# Altium schematic sheet PRG_v2.0.SchDoc
size 419 x 296 mm
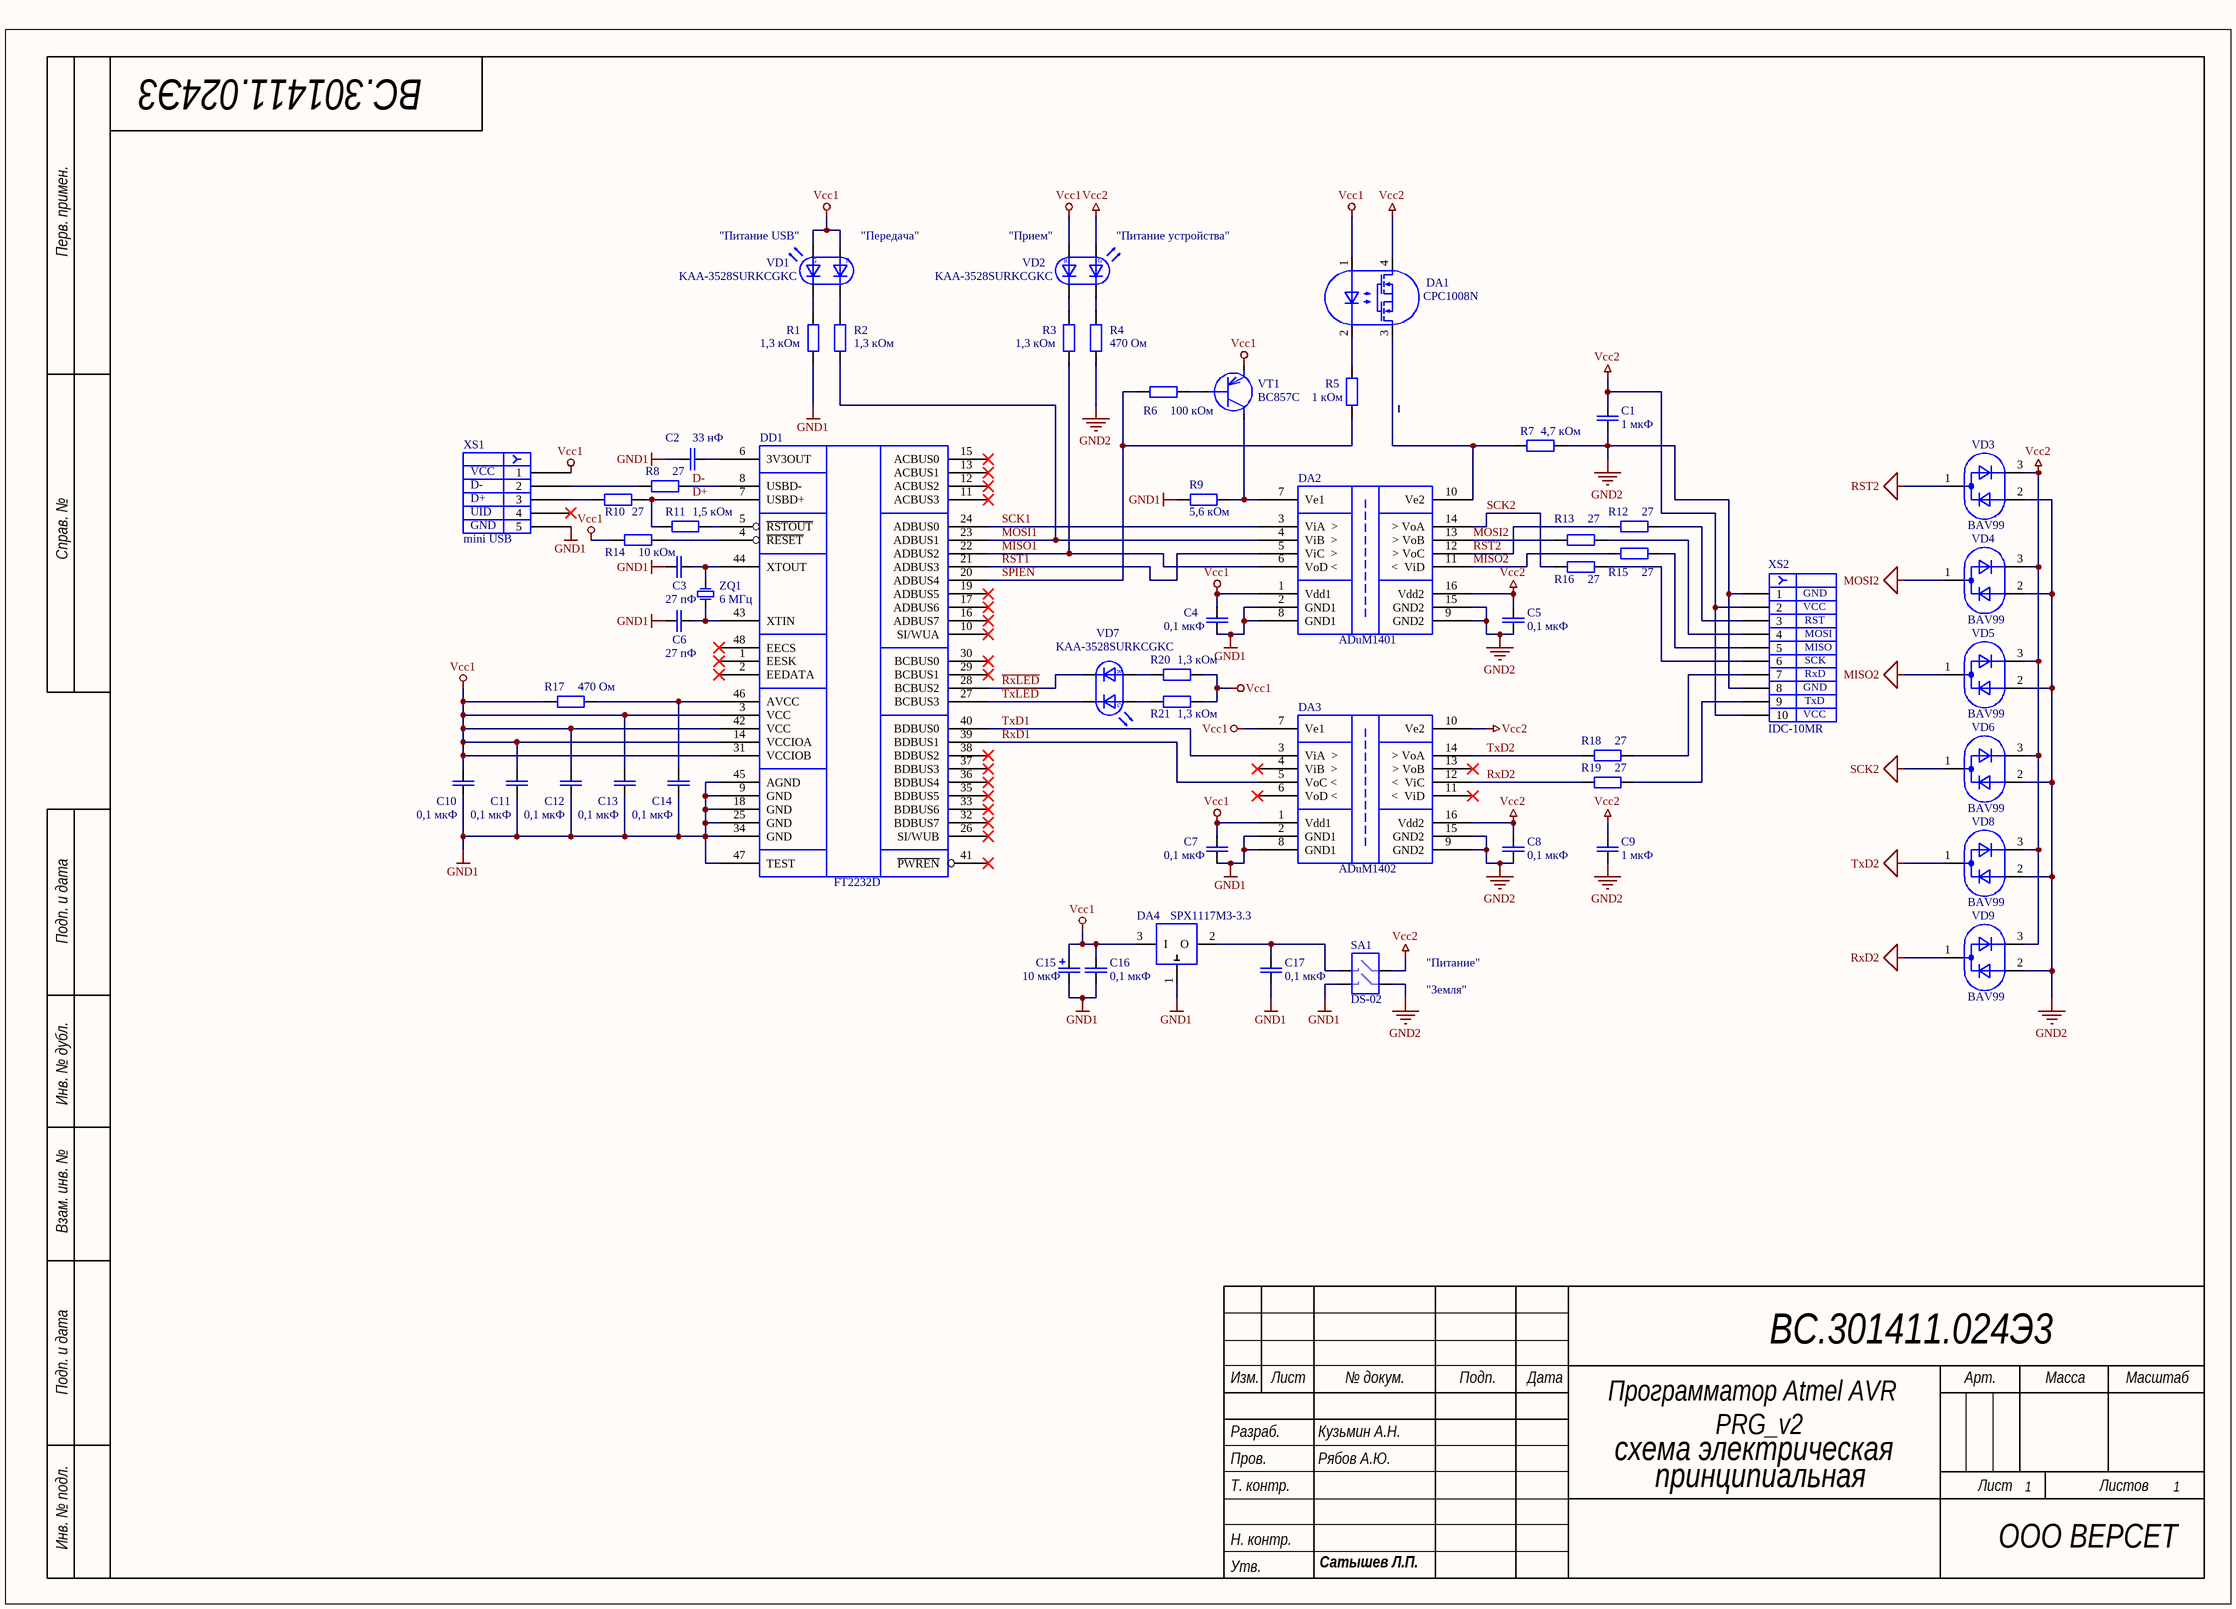
[diagram p0: PRG_v2.0.SchDoc]

## Parts
C1  Номинал: 1 мкФ  [0603]  (hidden comment: Конденсатор)
C2  Номинал: 33 нФ  [0603]  (hidden comment: Конденсатор)
C3  Номинал: 27 пФ  [0603]  (hidden comment: Конденсатор)
C4  Номинал: 0,1 мкФ  [0603]  (hidden comment: Конденсатор)
C5  Номинал: 0,1 мкФ  [0603]  (hidden comment: Конденсатор)
C6  Номинал: 27 пФ  [0603]  (hidden comment: Конденсатор)
C7  Номинал: 0,1 мкФ  [0603]  (hidden comment: Конденсатор)
C8  Номинал: 0,1 мкФ  [0603]  (hidden comment: Конденсатор)
C9  Номинал: 1 мкФ  [0603]  (hidden comment: Конденсатор)
C10  Номинал: 0,1 мкФ  [0603]  (hidden comment: Конденсатор)
C11  Номинал: 0,1 мкФ  [0603]  (hidden comment: Конденсатор)
C12  Номинал: 0,1 мкФ  [0603]  (hidden comment: Конденсатор)
C13  Номинал: 0,1 мкФ  [0603]  (hidden comment: Конденсатор)
C14  Номинал: 0,1 мкФ  [0603]  (hidden comment: Конденсатор)
C15  Номинал: 10 мкФ  [C+A]  (hidden comment: Конденсатор электролитический)
C16  Номинал: 0,1 мкФ  [0603]  (hidden comment: Конденсатор)
C17  Номинал: 0,1 мкФ  [0603]  (hidden comment: Конденсатор)
DA1  Оптопара  [SOIC4]  (value not drawn)
DA2  Буфер с гальванической развязкой  [SOIC16]  (value not drawn)
DA3  Буфер с гальванической развязкой  [SOIC16]  (value not drawn)
DA4  Type: SPX1117M3-3.3  [SOT223]  (hidden comment: Стабилизатор напряжения)
DD1  Dual USB to Serial UART/FIFO IC  [LQFP48]  (value not drawn)
R1  Номинал: 1,3 кОм  [0603]  (hidden comment: Резистор)
R2  Номинал: 1,3 кОм  [0603]  (hidden comment: Резистор)
R3  Номинал: 1,3 кОм  [0603]  (hidden comment: Резистор)
R4  Номинал: 470 Ом  [0603]  (hidden comment: Резистор)
R5  Номинал: 1 кОм  [0603]  (hidden comment: Резистор)
R6  Номинал: 100 кОм  [0603]  (hidden comment: Резистор)
R7  Номинал: 4,7 кОм  [0603]  (hidden comment: Резистор)
R8  Номинал: 27  [0603]  (hidden comment: Резистор)
R9  Номинал: 5,6 кОм  [0603]  (hidden comment: Резистор)
R10  Номинал: 27  [0603]  (hidden comment: Резистор)
R11  Номинал: 1,5 кОм  [0603]  (hidden comment: Резистор)
R12  Номинал: 27  [0603]  (hidden comment: Резистор)
R13  Номинал: 27  [0603]  (hidden comment: Резистор)
R14  Номинал: 10 кОм  [0603]  (hidden comment: Резистор)
R15  Номинал: 27  [0603]  (hidden comment: Резистор)
R16  Номинал: 27  [0603]  (hidden comment: Резистор)
R17  Номинал: 470 Ом  [0603]  (hidden comment: Резистор)
R18  Номинал: 27  [0603]  (hidden comment: Резистор)
R19  Номинал: 27  [0603]  (hidden comment: Резистор)
R20  Номинал: 1,3 кОм  [0603]  (hidden comment: Резистор)
R21  Номинал: 1,3 кОм  [0603]  (hidden comment: Резистор)
SA1  Микропереключатель  [DS-02]  (value not drawn)
VD1  Светодиод двухцветный  [KAA-3528SURKCGKC]  (value not drawn)
VD2  Светодиод двухцветный  [KAA-3528SURKCGKC]  (value not drawn)
VD3  Пара защитный диодов Шоттки  [SOT23]  (value not drawn)
VD4  Пара защитный диодов Шоттки  [SOT23]  (value not drawn)
VD5  Пара защитный диодов Шоттки  [SOT23]  (value not drawn)
VD6  Пара защитный диодов Шоттки  [SOT23]  (value not drawn)
VD7  Светодиод двухцветный  [KAA-3528SURKCGKC]  (value not drawn)
VD8  Пара защитный диодов Шоттки  [SOT23]  (value not drawn)
VD9  Пара защитный диодов Шоттки  [SOT23]  (value not drawn)
VT1  Type: BC857C  [SOT23]  (hidden comment: Транзистор pnp)
XS1  Разъем мини-USB  [mini USB A]  (value not drawn)
XS2  IDC-10MR  [IDC-10MR]
ZQ1  Номинал: 6 МГц  [HC49-SM]  (hidden comment: Кварцевый резонатор)

## Nets
GND1: C2.1 C3.1 C4.1 C6.1 C7.1 C10.2 C11.2 C12.2 C13.2 C14.2 C15.2 C16.1 C17.1 DA2.2(GND1) DA2.8(GND1) DA3.2(GND1) DA3.8(GND1) DA4.1(GND) DD1.9(GND) DD1.18(GND) DD1.25(GND) DD1.34(GND) DD1.45(AGND) DD1.47(TEST) R1.1 R9.2 SA1.4 XS1.5
GND2: C1.1 C5.1 C8.1 C9.1 DA2.9(GND2) DA2.15(GND2) DA3.9(GND2) DA3.15(GND2) R4.2 R7.1 SA1.2 VD3.2 VD4.2 VD5.2 VD6.2 VD8.2 VD9.2 XS2.1 XS2.8
MISO2: DA2.11(<__ViD) R15.1 VD5.1
MOSI2: DA2.13(>_VoB) R13.1 VD4.1
RST2: DA2.12(>_VoC) R12.1 VD3.1
RxD2: DA3.12(<__ViC) R19.1 VD9.1
SCK2: DA2.14(>_VoA) R16.1 VD6.1
TxD2: DA3.14(>_VoA) R18.1 VD8.1
Vcc1: C4.2 C7.2 C10.1 C11.1 C12.1 C13.1 C15.1 C16.2 DA1.1(A) DA2.1(Vdd1) DA3.1(Vdd1) DA3.7(Ve1) DA4.3(I) DD1.3(VCC) DD1.14(VCCIOA) DD1.31(VCCIOB) DD1.42(VCC) R14.1 R17.1 R20.1 R21.1 VD1.2 VD1.4 VD2.2 VT1.3(Emitter) XS1.1
Vcc2: C1.2 C5.2 C8.2 C9.2 DA1.4(C) DA2.16(Vdd2) DA3.10(Ve2) DA3.16(Vdd2) SA1.1 VD2.4 VD3.3 VD4.3 VD5.3 VD6.3 VD8.3 VD9.3 XS2.2 XS2.10
D+: DD1.7(USBD+) R10.2 R11.1
D-: DD1.8(USBD-) R8.2
MISO1: DA2.6(VoD_<) DD1.22(ADBUS2) R3.1
MOSI1: DA2.4(ViB__>) DD1.23(ADBUS1) R2.1
~{RST}1: DA2.5(ViC__>) DD1.21(ADBUS3)
~{RxLED}: DD1.28(BCBUS2) VD7.1
RxD1: DA3.5(VoC_<) DD1.39(BDBUS1)
~{SPIEN}: DD1.20(ADBUS4) R5.1 R6.2
SCK1: DA2.3(ViA__>) DD1.24(ADBUS0)
~{TxLED}: DD1.27(BCBUS3) VD7.3
TxD1: DA3.3(ViA__>) DD1.40(BDBUS0)
NetC2_2: C2.2 DD1.6(3V3OUT)
NetC3_2: C3.2 DD1.44(XTOUT) ZQ1.2
NetC6_2: C6.2 DD1.43(XTIN) ZQ1.1
NetC14_1: C14.1 DD1.46(AVCC) R17.2
NetC17_2: C17.2 DA4.2(O) SA1.3
NetDA1_2: DA1.2(K) R5.2
NetDA1_3: DA1.3(E) DA2.10(Ve2) R7.2
NetDA2_7: DA2.7(Ve1) R9.1 VT1.1(Collector)
NetDD1_4: DD1.4(~{RESET}) R14.2
NetDD1_5: DD1.5(~{RSTOUT}) R11.2
NetR1_2: R1.2 VD1.3
NetR2_2: R2.2 VD1.1
NetR3_2: R3.2 VD2.1
NetR4_1: R4.1 VD2.3
NetR6_1: R6.1 VT1.2(Base)
NetR8_1: R8.1 XS1.2
NetR10_1: R10.1 XS1.3
NetR12_2: R12.2 XS2.3
NetR13_2: R13.2 XS2.4
NetR15_2: R15.2 XS2.5
NetR16_2: R16.2 XS2.6
NetR18_2: R18.2 XS2.7
NetR19_2: R19.2 XS2.9
NetR20_2: R20.2 VD7.2
NetR21_2: R21.2 VD7.4

Not connected (* = marked no-connect by the designer): DA3 4(ViB__>)* 6(VoD_<)* 11(<__ViD)* 13(>_VoB)*; DD1 1(EESK)* 2(EEDATA)* 10(SI/WUA)* 11(ACBUS3)* 12(ACBUS2)* 13(ACBUS1)* 15(ACBUS0)* 16(ADBUS7)* 17(ADBUS6)* 19(ADBUS5)* 26(SI/WUB)* 29(BCBUS1)* 30(BCBUS0)* 32(BDBUS7)* 33(BDBUS6)* 35(BDBUS5)* 36(BDBUS4)* 37(BDBUS3)* 38(BDBUS2)* 41(~{PWREN})* 48(EECS)*; XS1 4*

## Notes on the sheet
- ВС.301411.024Э3
- (near VD1) "Питание USB"
- (near VD1) "Передача"
- (near VD2) "Прием"
- (near VD2) "Питание устройства"
- (near SA1) "Земля"
- (near SA1) "Питание"
- Программатор Atmel AVR
- PRG_v2
- 1
- Перв. примен.
- Справ. №
- Подп. и дата
- Инв. № дубл.
- Взам. инв. №
- Изм.
- Лист
- № докум.
- Подп.
- Дата
- Арт.
- Масса
- Масштаб
- Разраб.
- Пров.
- Т. контр.
- Кузьмин А.Н.
- Рябов А.Ю.
- cхема электрическая
- принципиальная
- Листов
- Инв. № подл.
- Н. контр.
- ООО ВЕРСЕТ
- Утв.
- Сатышев Л.П.
- (in symbol IDC-10MR) GND; VCC; RST; MOSI; MISO; SCK; RxD; TxD
- (in symbol miniUSB) VCC; D-; D+; UID; GND; mini USB
- (in symbol Светодиод RG) G; R

## Library data of the parts
C1-C14 C16 C17 = C
C15 = C+
DA1 = CPC1008N: Оптореле
DA2 = ADuM1401
DA3 = ADuM1402
DA4 = VREG
DD1 = FT2232D
R1-R21 = R
SA1 = DS-02: Тип: DS-02
VD1 VD2 VD7 = Светодиод RG: Тип: KAA-3528SURKCGKC
VD3-VD6 VD8 VD9 = BAV99
VT1 = PNP
XS1 = miniUSB
ZQ1 = ZQ
XS2 = IDC-10MR: Тип: IDC-10MR